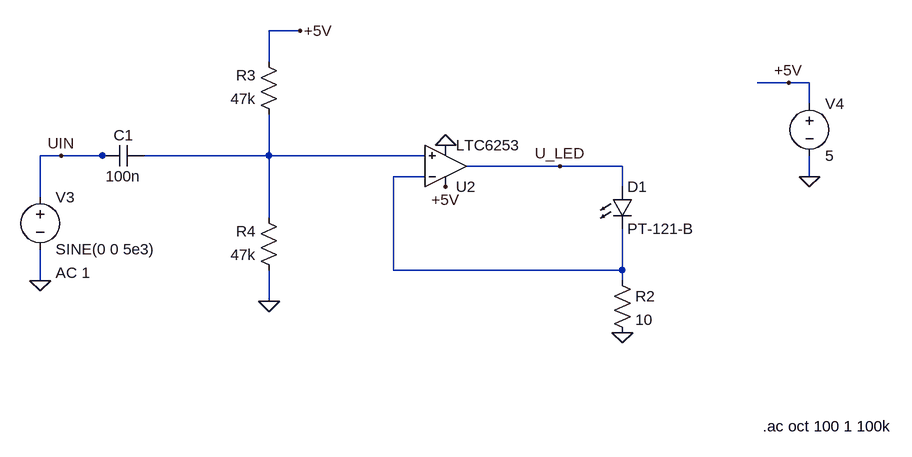
[diagram p0: schematic ALDO_LED_Driver_ac.asc]
ALDO_LED_Driver_ac.asc, the LTspice schematic file:
Version 4
SHEET 1 920 1220
WIRE -816 32 -864 32
WIRE -864 80 -864 32
WIRE -64 112 -112 112
WIRE -32 112 -64 112
WIRE -32 144 -32 112
WIRE -1184 224 -1216 224
WIRE -1120 224 -1184 224
WIRE -1104 224 -1120 224
WIRE -864 224 -864 160
WIRE -864 224 -1056 224
WIRE -624 224 -864 224
WIRE -416 240 -560 240
WIRE -320 240 -416 240
WIRE -624 256 -672 256
WIRE -32 256 -32 224
WIRE -320 272 -320 240
WIRE -1216 288 -1216 224
WIRE -864 320 -864 224
WIRE -672 400 -672 256
WIRE -320 400 -320 336
WIRE -320 400 -672 400
WIRE -1216 416 -1216 368
WIRE -320 416 -320 400
WIRE -864 448 -864 400
FLAG -32 256 0
FLAG -1216 416 0
FLAG -1184 224 UIN
FLAG -320 496 0
FLAG -864 448 0
FLAG -416 240 U_LED
FLAG -816 32 +5V
FLAG -64 112 +5V
FLAG -592 272 +5V
FLAG -592 208 0
SYMBOL voltage -1216 272 R0
WINDOW 123 24 132 Left 2
WINDOW 39 0 0 Left 2
SYMATTR Value2 AC 1
SYMATTR InstName V3
SYMATTR Value SINE(0 0 5e3)
SYMBOL voltage -32 128 R0
WINDOW 123 0 0 Left 2
WINDOW 39 24 44 Left 2
SYMATTR InstName V4
SYMATTR Value 5
SYMBOL res -848 176 R180
WINDOW 0 36 76 Left 2
WINDOW 3 36 40 Left 2
SYMATTR InstName R3
SYMATTR Value 47k
SYMBOL res -848 416 R180
WINDOW 0 36 76 Left 2
WINDOW 3 36 40 Left 2
SYMATTR InstName R4
SYMATTR Value 47k
SYMBOL LED -336 272 R0
SYMATTR InstName D1
SYMATTR Value PT-121-B
SYMBOL res -336 400 R0
SYMATTR InstName R2
SYMATTR Value 10
SYMBOL cap -1056 208 R90
WINDOW 0 0 32 VBottom 2
WINDOW 3 32 32 VTop 2
SYMATTR InstName C1
SYMATTR Value 100n
SYMBOL LTC6253 -592 240 M180
SYMATTR InstName U2
TEXT -104 640 Left 2 !.ac oct 100 1 100k

The netlist it stands for:
* ALDO_LED_Driver_ac.asc
V3 UIN 0 SINE(0 0 5e3) AC 1
V4 +5V 0 5
R3 N001 +5V 47k
R4 0 N001 47k
D1 U_LED N002 PT-121-B
R2 N002 0 10
C1 N001 UIN 100n
* U2: LTC6253 (symbol LTC6253 not available, pins judged from their places): In+=N001 In-=N002 V+=+5V V-=0 OUT=U_LED
.model D D
.lib standard.dio
.ac oct 100 1 100k
.backanno
.end